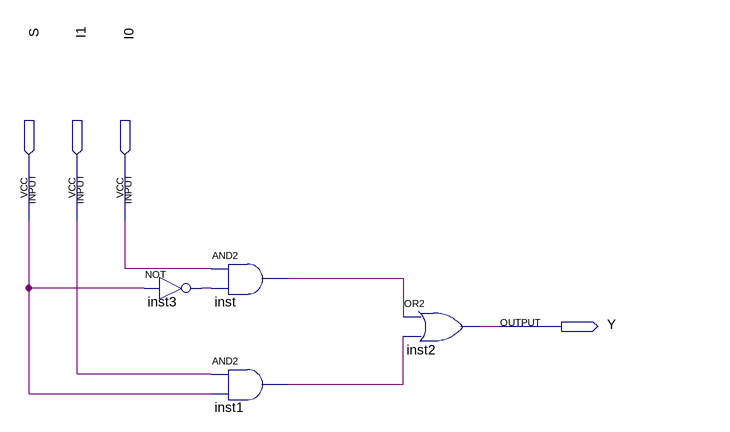
[diagram p0: schematic sheet]
// Quartus schematic Mux2_1.bdf as structural Verilog: 4 symbols, 4 pins
module Mux2_1 (
  input  S,
  input  I1,
  input  I0,
  output Y
);

  wire inst1_out, inst3_out, inst_out;

  and inst (inst_out, I0, inst3_out);
  not inst3 (inst3_out, S);
  and inst1 (inst1_out, I1, S);
  or inst2 (Y, inst_out, inst1_out);
endmodule
